# EAGLE design mpg-200-prototype_v4 (EAGLE 7.2.0)
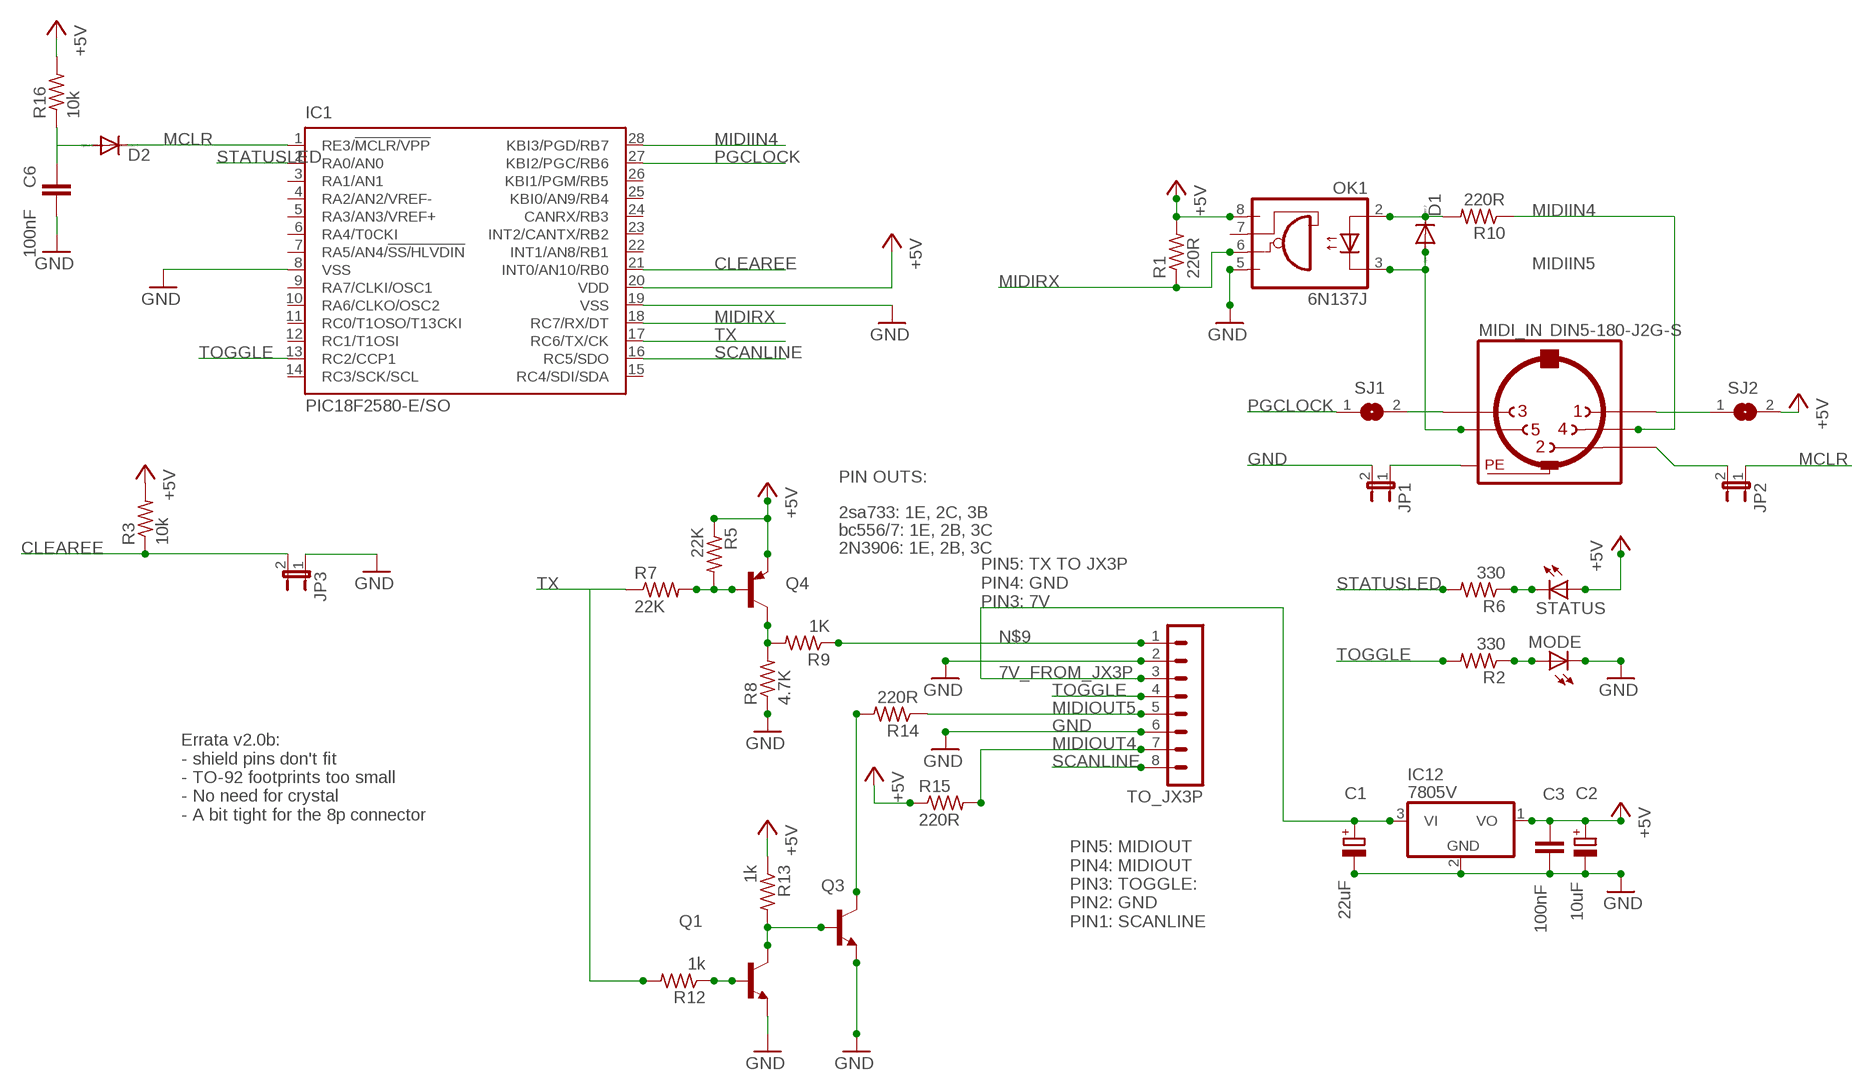
[diagram p0: schematic, sheet 1]

## Parts
C1  22uF  CPOL-EUE2.5-5  [E2,5-5]
C2  10uF  CPOL-EUE2.5-5  [E2,5-5]
C3  100nF  C-EUC0805  [C0805]
C6  100nF  C-EUC0805  [C0805]
D1  DIODE-SOD80C  [SOD80C]
D2  DIODE-SOD80C  [SOD80C]
IC1  PIC18F2580-E/SO  [SO28W]
IC12  7805V  7805L  [TO92]
JP1  JP1E  [JP1]
JP2  JP1E  [JP1]
JP3  JP1E  [JP1]
MIDI_IN  DIN5-180-J2G-S  [DIN5-180-J-DUAL-GND-SHORT]
MODE  LED3MM  [LED3MM]
OK1  6N137J  [DIL08-J]
Q1  2N3904-NPN-TO92-EBC  [TO92-EBC]
Q3  2N3904-NPN-TO92-EBC  [TO92-EBC]
Q4  2N3906-PNP-TO92-EBC  [TO92-EBC]
R1  220R  R-US_R0805  [R0805]
R2  330  R-US_R0805  [R0805]
R3  10k  R-US_R0805  [R0805]
R5  22K  R-US_R0805  [R0805]
R6  330  R-US_R0805  [R0805]
R7  22K  R-US_R0805  [R0805]
R8  4.7K  R-US_R0805  [R0805]
R9  1K  R-US_R0805  [R0805]
R10  220R  R-US_R0805  [R0805]
R12  1k  R-US_R0805  [R0805]
R13  1k  R-US_R0805  [R0805]
R14  220R  R-US_R0805  [R0805]
R15  220R  R-US_R0805  [R0805]
R16  10k  R-US_R0805  [R0805]
SJ1  SJ  [SJ]
SJ2  SJ  [SJ]
STATUS  LED3MM  [LED3MM]
TO_JX3P  MA08-1  [MA08-1]

## Nets
7V_FROM_JX3P: C1.+ IC12.3(VI) TO_JX3P.3
+5V: C2.+ C3.1 IC1.20(VDD) IC12.1(VO) OK1.8(VCC) Q4.E R1.2 R3.2 R5.1 R13.1 R15.1 R16.2 SJ2.2 STATUS.A
CLEAREE: IC1.21(INT0/AN10/RB0) JP3.2 R3.1
GND: C1.- C2.- C3.2 C6.2 IC1.8(VSS) IC1.19(VSS) IC12.2(GND) JP1.2 JP3.1 MODE.K(C) OK1.5(GND) Q1.E Q3.E R8.1 TO_JX3P.2 TO_JX3P.6
MCLR: D2.C IC1.1(RE3/!MCLR/VPP) JP2.1
MIDIIN4: IC1.28(KBI3/PGD/RB7) MIDI_IN.4 R10.1
MIDIIN5: D1.A MIDI_IN.5 OK1.3(C)
MIDIOUT4: R15.2 TO_JX3P.7
MIDIOUT5: R14.1 TO_JX3P.5
MIDIRX: IC1.18(RC7/RX/DT) OK1.6(VO) R1.1
N$1: R6.1 STATUS.K(C)
N$2: Q4.B R5.2 R7.2
N$3: MODE.A R2.1
N$4: Q1.B R12.1
N$5: D1.C OK1.2(A) R10.2
N$6: Q4.C R8.2 R9.2
N$7: Q1.C Q3.B R13.2
N$8: Q3.C R14.2
N$9: R9.1 TO_JX3P.1
N$10: MIDI_IN.3 SJ1.2
N$11: JP2.2 MIDI_IN.2
N$12: MIDI_IN.1 SJ2.1
N$13: JP1.1 MIDI_IN.PE MIDI_IN.PE@1(PE) MIDI_IN.PE@2(PE) MIDI_IN.PE@3(PE)
N$14: C6.1 D2.A R16.1
PGCLOCK: IC1.27(KBI2/PGC/RB6) SJ1.1
SCANLINE: IC1.16(RC5/SDO) TO_JX3P.8
STATUSLED: IC1.2(RA0/AN0) R6.2
TOGGLE: IC1.13(RC2/CCP1) R2.2 TO_JX3P.4
TX: IC1.17(RC6/TX/CK) R7.1 R12.2
Unconnected: IC1.3(RA1/AN1) IC1.4(RA2/AN2/VREF-) IC1.5(RA3/AN3/VREF+) IC1.6(RA4/T0CKI) IC1.7(RA5/AN4/!SS/HLVDIN) IC1.9(RA7/CLKI/OSC1) IC1.10(RA6/CLKO/OSC2) IC1.11(RC0/T1OSO/T13CKI) IC1.12(RC1/T1OSI) IC1.14(RC3/SCK/SCL) IC1.15(RC4/SDI/SDA) IC1.22(INT1/AN8/RB1) IC1.23(INT2/CANTX/RB2) IC1.24(CANRX/RB3) IC1.25(KBI0/AN9/RB4) IC1.26(KBI1/PGM/RB5) OK1.7(VE)

## Notes on the sheet
- PIN OUTS:
- 2sa733: 1E, 2C, 3B
- bc556/7: 1E, 2B, 3C
- 2N3906: 1E, 2B, 3C
- PIN5: TX TO JX3P
  PIN4: GND
  PIN3: 7V
- Errata v2.0b:
  - shield pins don't fit
  - TO-92 footprints too small
  - No need for crystal
  - A bit tight for the 8p connector
- PIN5: MIDIOUT
  PIN4: MIDIOUT
  PIN3: TOGGLE:
  PIN2: GND
  PIN1: SCANLINE

## Library data of the parts
C1 C2 = rcl:CPOL-EU: POLARIZED CAPACITOR, European symbol
C3 C6 = resistor:C-EU: CAPACITOR, European symbol
D1 D2 = diode:DIODE-: DIODE
IC1 = microchip:PIC18F2*80: 28-Pin Enhanced Flash Microcontrollers with ECAN(TM) Technology 10-Bit A/D and nanoWatt Technology Source: http://www.microchip.com .. 39637a.pdf; MF: MICROCHIP; MPN: PIC18F2580-I/SO; OC_FARNELL: 9321284; OC_NEWARK: 71J7243
IC12 = linear:78*: Positive VOLTAGE REGULATOR Source: http://cache.national.com/ds/LM/LM78L05.pdf http://www.fairchildsemi.com/ds/LM/LM7805.pdf
JP1-JP3 = jumper:JP1E: JUMPER
MIDI_IN = joakim:DIN5-180-J: Female CONNECTOR 5 pins 90 deg. with shield, horizontal (DIN 41524)
MODE STATUS = led:LED: LED OSRAM: - CHIPLED LG R971, LG N971, LY N971, LG Q971, LY Q971, LO R971, LY R971 LH N974, LH R974 LS Q976, LO Q976, LY Q976 LO Q996 - Hyper CHIPLED LW Q18S LB Q993, LB Q99A, LB R99A - SideLED LS A670, LO A670, LY A670, LG A670, LP A670 LB A673, LV A673, LT A673, LW A673 LH A674 LY A675 LS A676, LA A676, LO A676, LY A676, LW A676 LS A679, LY A679, LG A679 - Hyper Micro SIDELED® LS Y876, LA Y876, LO Y876, LY Y876 LT Y87S - SmartLED LW L88C, LW L88S LB L89C, LB L89S, LG L890 LS L89K, LO L89K, LY L89K LS L896, LA L896, LO L896, LY L896 - TOPLED LS T670, LO T670, LY T670, LG T670, LP T670 LSG T670, LSP T670, LSY T670, LOP T670, LYG T670 LG T671, LOG T671, LSG T671 LB T673, LV T673, LT T673, LW T673 LH T674 LS T676, LA T676, LO T676, LY T676, LB T676, LH T676, LSB T676, LW T676 LB T67C, LV T67C, LT T67C, LS T67K, LO T67K, LY T67K, LW E67C LS E67B, LA E67B, LO E67B, LY E67B, LB E67C, LV E67C, LT E67C LW T67C LS T679, LY T679, LG T679 LS T770, LO T770, LY T770, LG T770, LP T770 LB T773, LV T773, LT T773, LW T773 LH T774 LS E675, LA E675, LY E675, LS T675 LS T776, LA T776, LO T776, LY T776, LB T776 LHGB T686 LT T68C, LB T68C - Hyper Mini TOPLED® LB M676 - Mini TOPLED Santana® LG M470 LS M47K, LO M47K, LY M47K Source: http://www.osram.convergy.de LUXEON: - LUMILED® LXK2-PW12-R00, LXK2-PW12-S00, LXK2-PW14-U00, LXK2-PW14-V00 LXK2-PM12-R00, LXK2-PM12-S00, LXK2-PM14-U00 LXK2-PE12-Q00, LXK2-PE12-R00, LXK2-PE12-S00, LXK2-PE14-T00, LXK2-PE14-U00 LXK2-PB12-K00, LXK2-PB12-L00, LXK2-PB12-M00, LXK2-PB14-N00, LXK2-PB14-P00, LXK2-PB14-Q00 LXK2-PR12-L00, LXK2-PR12-M00, LXK2-PR14-Q00, LXK2-PR14-R00 LXK2-PD12-Q00, LXK2-PD12-R00, LXK2-PD12-S00 LXK2-PH12-R00, LXK2-PH12-S00 LXK2-PL12-P00, LXK2-PL12-Q00, LXK2-PL12-R00 Source: www.luxeon.com KINGBRIGHT: KA-3528ASYC Source: www.kingbright.com
OK1 = joakim:6N137: MOTOROLA OPTO COUPLER
Q1 Q3 = transistor-neu-to92:*-NPN-: NPN Transistror
Q4 = transistor-neu-to92:*-PNP-: PNP Transistror
R1-R3 R5-R10 R12-R16 = resistor:R-US_: RESISTOR, American symbol
SJ1 SJ2 = jumper:SJ: SMD solder JUMPER
TO_JX3P = joakim:MA08-1: PIN HEADER; OC_FARNELL: unknown; OC_NEWARK: unknown

## Board
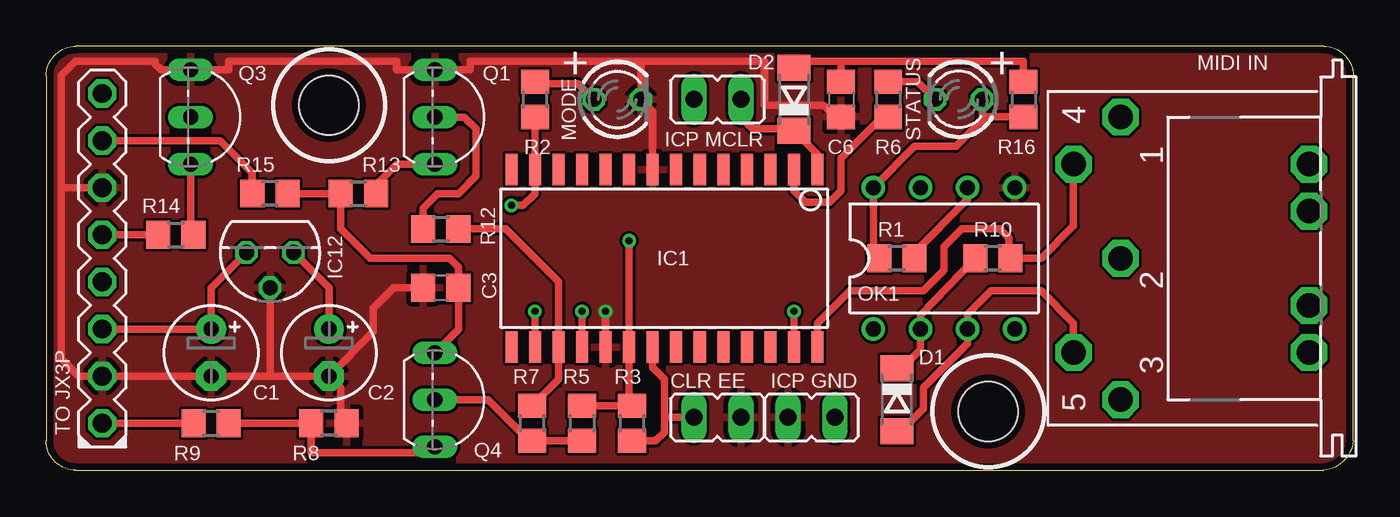
[diagram p1: board, top side]
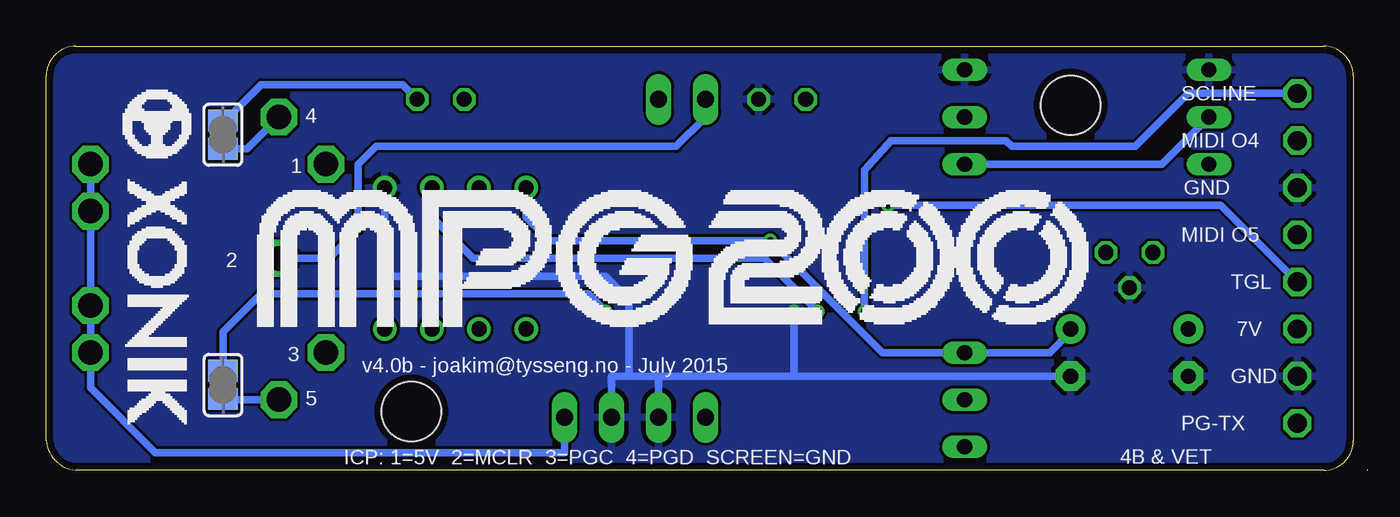
[diagram p2: board, bottom side, seen from below]

Size 70.48 x 22.86 mm. Coordinates in mm from the lower left corner, seen from the top.
Outline: 1.59,0 68.9,0 arc80 70.48,1.59 70.48,21.27 arc90 68.9,22.86 1.59,22.86 arc90 0,21.27 0,1.59 arc90 1.59,0
Copper layers (1*16): Top 0.0356mm / dielectric 1.5011mm / Bottom 0.0356mm
Design rules: minimum track width 6mil, minimum drill 13mil, track to track 6mil, track to pad 6mil, pad to pad 6mil, via to via 6mil, smd to smd 6mil, copper to edge 15mil, drill to drill 6mil, minimum pad ring 7mil, minimum via ring 7mil, stop-mask expansion 3mil, vias tented up to drill 0mil, thermal gap 10mil
Holes 3.2 mm at 50.8,3.17 15.24,19.68

### Footprints (pad centres in the part's own frame; a part is rotated, then mirrored left to right if it is on the bottom)
E2,5-5 = drill 0.813 pad 1.6: + -1.27,0 | drill 0.813 pad 1.6 octagon: - 1.27,0
C0805 = smd 1.3 x 1.5: 1 -0.95,0; 2 0.95,0
SOD80C = smd 1.4 x 1.8: A 1.7,0; C -1.7,0
SO28W = smd 0.65 x 1.7: 1 -7.62,-4.78; 2 -6.35,-4.78; 3 -5.08,-4.78; 4 -3.81,-4.78; 5 -2.54,-4.78; 6 -1.27,-4.78; 7 0,-4.78; 8 1.27,-4.78; 9 2.54,-4.78; 10 3.81,-4.78; 11 5.08,-4.78; 12 6.35,-4.78; 13 7.62,-4.78; 14 8.89,-4.78; 15 8.89,4.78; 16 7.62,4.78; 17 6.35,4.78; 18 5.08,4.78; 19 3.81,4.78; 20 2.54,4.78; 21 1.27,4.78; 22 0,4.78; 23 -1.27,4.78; 24 -2.54,4.78; 25 -3.81,4.78; 26 -5.08,4.78; 27 -6.35,4.78; 28 -7.62,4.78
TO92 = drill 0.813 octagon: 1 -1.27,0; 2 0,1.905; 3 1.27,0
JP1 = drill 0.914 long: 1 0,-1.27; 2 0,1.27
DIN5-180-J-DUAL-GND-SHORT = drill 1.321 octagon: 1 7.62,5.08; 2 0,5.08; 3 -7.62,5.08; 4 5.08,7.62; 5 -5.08,7.62; PE -2.54,-5.08; PE@1 5.08,-5.08; PE@2 2.54,-5.08; PE@3 -5.08,-5.08
LED3MM = drill 0.813 octagon: A -1.27,0; K 1.27,0
DIL08-J = drill 0.813 pad 1.27: 1 -3.81,-3.81; 2 -1.27,-3.81; 3 1.27,-3.81; 4 3.81,-3.81; 5 3.81,3.81; 6 1.27,3.81; 7 -1.27,3.81; 8 -3.81,3.81
TO92-EBC = drill 0.813 long: B 0,-1.27; C 2.54,-1.27; E -2.54,-1.27
R0805 = smd 1.3 x 1.5: 1 -0.95,0; 2 0.95,0
SJ = smd 1.168 x 1.6: 1 -0.762,0; 2 0.762,0
MA08-1 = drill 1.016 octagon: 1 -8.89,0; 2 -6.35,0; 3 -3.81,0; 4 -1.27,0; 5 1.27,0; 6 3.81,0; 7 6.35,0; 8 8.89,0

### Placement (x,y rotation side)
C1  8.89,6.35 270 top
C2  15.24,6.35 270 top
C3  21.27,9.84 180 top
C6  42.86,20 270 top
D1  45.88,3.81 270 top
D2  40.32,20 90 top
IC1  33.97,11.43 180 top
IC12  12.06,11.75 180 top
JP1  41.27,2.86 90 top
JP2  36.2,20 90 top
JP3  36.2,2.86 90 top
MIDI_IN  63.02,11.43 90 top
MODE  30.8,20 0 top
OK1  48.42,11.43 0 top
Q1  22.23,19.05 270 top
Q3  9.05,19.05 270 top
Q4  22.23,3.81 270 top
R1  45.88,11.43 180 top
R2  26.35,20 270 top
R3  31.59,2.54 90 top
R5  28.89,2.54 270 top
R6  45.4,20 270 top
R7  26.19,2.54 270 top
R8  15.24,2.54 180 top
R9  8.89,2.54 0 top
R10  51.05,11.43 180 top
R12  21.27,13.02 0 top
R13  16.83,14.92 0 top
R14  6.99,12.7 0 top
R15  12.06,14.92 180 top
R16  52.7,20 270 top
SJ1  60.96,4.6 270 bottom
SJ2  60.96,18.1 90 bottom
STATUS  49.21,20 180 top
TO_JX3P  3.02,11.43 90 top

### Tracks (layer width: path | path; a pad name or v marks a point on that pad's centre or on a via)
7V_FROM_JX3P
  Top 0.406: IC12.3 8.89,9.84 C1.+ TO_JX3P.3
+5V  (via drill 0.38)
  Top 0.406: R1.2 44.61,11.75 OK1.8 46.83,17.46 49.05,17.46 50.48,18.89 | STATUS.A 50.48,18.89 | R13.1 15.72,14.92 | 13.34,14.92 13.18,14.92 | 13.18,14.92 13.34,14.76 13.34,14.92 | v31.43,12.38 IC1.20 31.43,3.65 R3.2 R5.1 | 13.18,14.92 R15.1 | Q4.E 22.22,7.62 C3.1 22.23,10.63 22.23,10.95 21.75,11.43 17.46,11.43 15.88,13.02 15.88,14.76 15.72,14.92 | IC12.1 15.24,9.84 C2.+ | 13.34,14.92 15.72,14.92 | R16.2 50.64,19.05 50.48,18.89
  Bottom 0.406: OK1.8 44.61,13.65 43.34,12.38 v31.43,12.38 25.4,6.35 Q4.E 16.35,6.35 15.24,7.46 C2.+ | SJ2.2 60.83,18.86 58.9,20.8 51.28,20.8 STATUS.A
CLEAREE
  Top 0.406: IC1.21 32.7,5.56 33.34,4.92 33.34,2.86 | 33.34,2.86 33.34,2.06 32.86,1.59 R3.1 | JP3.2 33.34,2.86
GND  (via drill 0.38)
  Top 0.406: R8.1 15.88,2.54 15.88,4.45 C2.- | IC12.2 12.06,5.08 | 12.06,5.08 C1.- TO_JX3P.2 1.75,5.08 0.79,6.03 0.79,15.24 | 12.06,5.08 C2.- | 0.79,15.24 0.79,21.27 1.59,22.07 5.87,22.07 5.87,21.91 6.19,21.59 Q3.E 9.84,21.59 9.84,22.07 18.89,22.07 18.89,21.59 Q1.E 22.86,21.59 22.86,22.07 32.07,22.07 | TO_JX3P.6 0.79,15.24 | IC1.19 v30.16,8.57 | C6.2 42.44,19.15 41.91,19.68 38.73,19.68 38.73,22.07 32.07,22.07 | IC1.8 32.7,19.37 MODE.K 32.07,22.07 | C2.- 17.62,7.46 17.62,8.73 18.73,9.84 C3.2
  Bottom 0.406: v30.16,8.57 30.16,5.08 | 30.16,5.08 C2.- | 30.16,5.08 37.47,5.08 | 37.47,5.08 39.05,5.08 | JP1.2 40.01,5.08 39.05,5.08 | OK1.5 52.23,10.48 40.32,10.48 39.05,9.21 39.05,5.08 | JP3.1 37.47,5.08
  pour Top: 0,22.86 0,0 70.33,0 70.33,22.86
  pour Bottom: -0.48,23.34 -0.48,-0.48 70.64,-0.48 70.8,-0.32 70.8,23.18 -0.32,23.18
MCLR
  Top 0.406: JP2.1 37.47,19.05 38.1,18.41 40.21,18.41 D2.C 41.59,17.03 IC1.1
MIDIIN4
  Top 0.406: MIDI_IN.4 55.4,13.18 53.66,11.43 R10.1 51.91,11.44 51.91,12.54 51.44,13.02 49.37,13.02 48.42,12.06 48.42,10.79 47.31,9.68 43.34,9.68 41.59,7.94 IC1.28
MIDIIN5
  Top 0.406: MIDI_IN.5 55.4,7.94 53.66,9.68 50.96,9.68 49.69,8.41 OK1.3 49.69,6.83 47.31,4.45 47.31,3.33 46.08,2.11 D1.A
MIDIOUT4
  Top 0.406: TO_JX3P.7 9.37,17.78 11.11,16.03 R15.2
MIDIOUT5
  Top 0.406: TO_JX3P.5 R14.1
MIDIRX  (via drill 0.38)
  Top 0.406: R1.1 46.73,11.64 49.69,14.61 OK1.6 | IC1.18 v28.89,8.57
  Bottom 0.406: v28.89,8.57 31.75,11.43 47.47,11.43 49.69,13.65 OK1.6
N$1
  Top 0.406: R6.1 46.99,20.95 STATUS.K
N$2
  Top 0.406: Q4.B 23.81,3.81 25.88,1.75 26.04,1.75 R7.2 R5.2
N$3
  Top 0.406: MODE.A 28.68,20.85 26.45,20.85 R2.1
N$4
  Top 0.406: R12.1 20.32,14.13 21.11,14.92 22.23,14.92 23.18,15.88 23.18,18.41 22.54,19.05 Q1.B
N$5
  Top 0.406: R10.2 47.15,8.38 OK1.2 47.15,6.51 46.15,5.51 D1.C
N$6
  Top 0.406: Q4.C 20.95,0.95 14.29,0.95 14.29,2.44 R8.2 R9.2
N$7
  Top 0.406: R13.2 17.78,15.4 18.89,16.51 Q1.C
  Bottom 0.406: Q1.C 10.32,16.51 Q3.B
N$8
  Top 0.406: Q3.C 7.78,12.28 R14.2
N$9
  Top 0.406: TO_JX3P.1 R9.1
N$10
  Bottom 0.406: MIDI_IN.3 60.93,3.81 SJ1.2
N$11
  Bottom 0.406: MIDI_IN.2 55.24,11.43 53.66,13.02 53.66,16.51 52.7,17.46 36.51,17.46 34.92,19.05 JP2.2
N$12
  Bottom 0.406: SJ2.1 59.66,17.34 MIDI_IN.1
N$13
  Bottom 0.406: JP1.1 42.55,0.95 64.61,0.95 68.1,4.45 MIDI_IN.PE@1
N$14
  Top 0.406: R16.1 52.7,22.07 42.86,22.07 | 42.86,22.07 40.37,22.07 D2.A | C6.1 42.86,22.07
PGCLOCK  (via drill 0.38)
  Top 0.406: v40.32,8.57 IC1.27
  Bottom 0.406: SJ1.1 60.96,7.46 58.9,9.53 41.27,9.53 v40.32,8.57
SCANLINE  (via drill 0.38)
  Top 0.406: v26.35,8.57 IC1.16
  Bottom 0.406: TO_JX3P.8 8.89,20.32 11.75,17.46 18.41,17.46 18.73,17.78 24.92,17.78 26.35,16.19 v26.35,8.57
STATUSLED
  Top 0.406: IC1.2 40.32,15.08 40.96,14.45 42.23,14.45 42.86,15.08 42.86,16.83 45.24,19.21 R6.2
TOGGLE  (via drill 0.38)
  Top 0.406: v25.08,14.29 25.72,14.29 26.35,14.92 IC1.13 R2.2
  Bottom 0.406: TO_JX3P.4 7.14,14.29 v25.08,14.29
TX
  Top 0.406: R12.2 24.77,13.02 27.62,10.16 IC1.17 27.62,4.92 R7.1

### Text on the board
tPlace: + | +
tNames: MIDI IN | ICP MCLR | CLR EE | ICP GND | TO JX3P
bNames: SCLINE | 4 | MIDI O4 | 1 | GND | MIDI O5 | 2 | TGL | 7V | 3 | GND | v4.0b - joakim@tysseng.no - July 2015 | 5 | PG-TX | 4B & VET | ICP: 1=5V 2=MCLR 3=PGC 4=PGD SCREEN=GND